# EAGLE design dev_board_v0.1 (EAGLE 8.0.1)
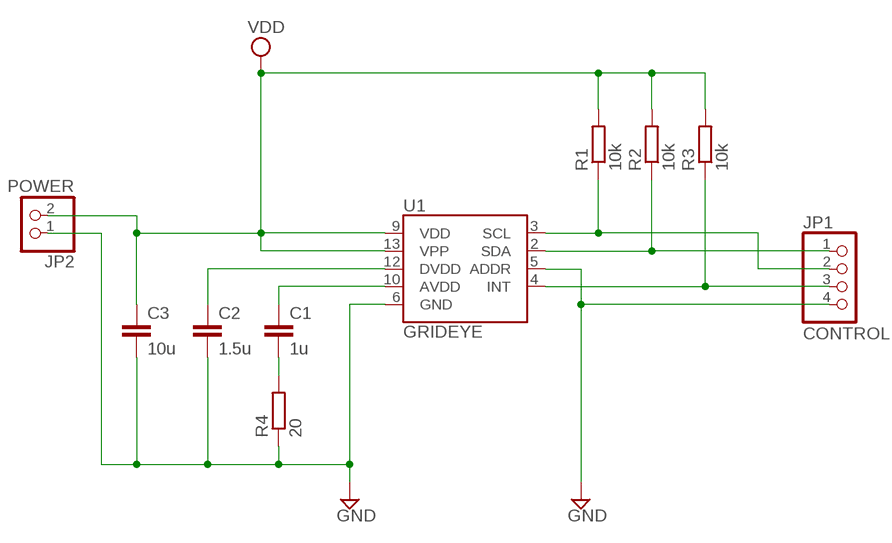
[diagram p0: schematic, sheet 1]

## Parts
C1  1u  C-EUC0805  [C0805]
C2  1.5u  C-EUC0805  [C0805]
C3  10u  C-EUC0805  [C0805]
JP1  CONTROL  PINHD-1X4  [1X04]
JP2  POWER  PINHD-1X2  [1X02]
R1  10k  R-EU_R0805  [R0805]
R2  10k  R-EU_R0805  [R0805]
R3  10k  R-EU_R0805  [R0805]
R4  20  R-EU_R0805  [R0805]
U1  GRIDEYE  [GRIDEYE-AMG88]

## Nets
AVDD: C1.1 U1.10(AVDD)
DVDD: C2.1 U1.12(DVDD)
GND: C2.2 C3.2 JP1.4 JP2.1 R4.1 U1.5(ADDR) U1.6(GND)
INT: JP1.3 R3.1 U1.4(INT)
N$6: C1.2 R4.2
SCL: JP1.2 R1.1 U1.3(SCL)
SDA: JP1.1 R2.1 U1.2(SDA)
VDD: C3.1 JP2.2 R1.2 R2.2 R3.2 U1.9(VDD) U1.13(VPP)

## Library data of the parts
C1-C3 = resistor:C-EU: CAPACITOR, European symbol
JP1 = pinhead:PINHD-1X4: PIN HEADER
JP2 = pinhead:PINHD-1X2: PIN HEADER
R1-R4 = resistor:R-EU_: RESISTOR, European symbol
U1 = Grideye:GRIDEYE

## Board
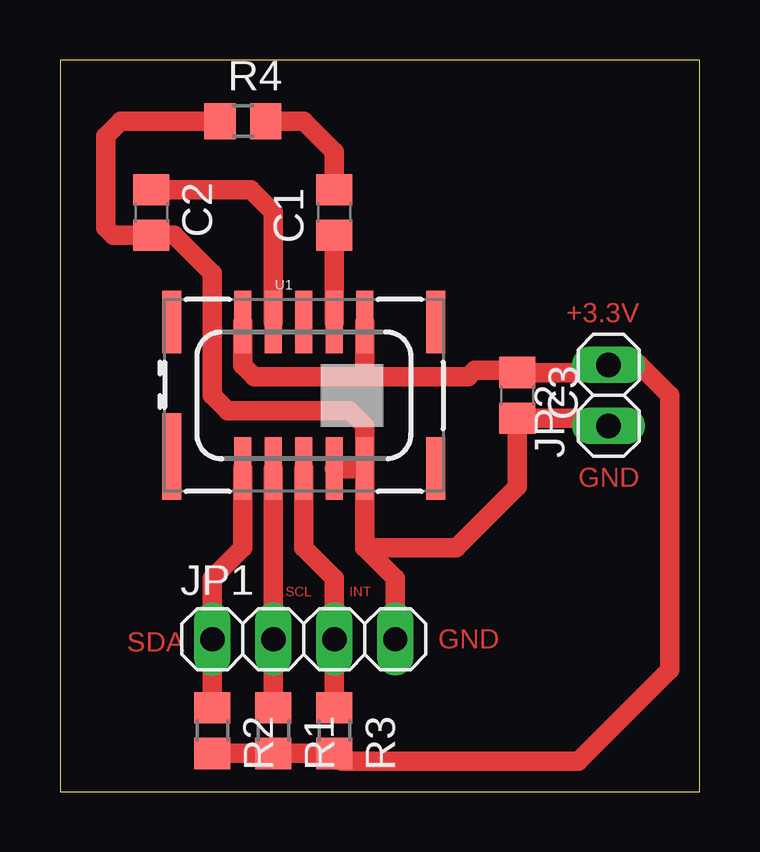
[diagram p1: board, top side]

Size 26.65 x 30.48 mm. Coordinates in mm from the lower left corner, seen from the top.
Outline: 0,0 26.65,0 26.65,30.48 0,30.48 0,0
Copper layers (1*16): Top 0.035mm / dielectric 1.5mm / Bottom 0.035mm
Design rules "default": minimum track width 10mil, minimum drill 24mil, track to track 8mil, track to pad 8mil, pad to pad 8mil, via to via 8mil, smd to smd 8mil, copper to edge 40mil, drill to drill 8mil, minimum pad ring 10mil, minimum via ring 8mil, stop-mask expansion 4mil, vias tented up to drill 0mil, thermal gap 10mil

### Footprints (pad centres in the part's own frame; a part is rotated, then mirrored left to right if it is on the bottom)
C0805 = smd 1.3 x 1.5: 1 -0.95,0; 2 0.95,0
1X04 = drill 1.016 long: 1 -3.81,0; 2 -1.27,0; 3 1.27,0; 4 3.81,0
1X02 = drill 1.016 long: 1 -1.27,0; 2 1.27,0
R0805 = smd 1.3 x 1.5: 1 -0.95,0; 2 0.95,0
GRIDEYE-AMG88 = smd 0.8 x 3.6: 1 -5.5,-2.55 | smd 0.7 x 2.6: 2 -2.54,-3.05; 3 -1.27,-3.05; 4 0,-3.05; 5 1.27,-3.05; 6 2.54,-3.05; 9 2.54,3.05; 10 1.27,3.05; 11 0,3.05; 12 -1.27,3.05; 13 -2.54,3.05 | smd 0.8 x 2.6: 7 5.5,-3.05; 8 5.5,3.05; 14 -5.5,3.05

### Placement (x,y rotation side)
C1  11.43,24.13 90 top
C2  3.81,24.13 270 top
C3  19.05,16.51 270 top
JP1  10.16,6.35 0 top
JP2  22.86,16.51 90 top
R1  8.89,2.54 270 top
R2  6.35,2.54 270 top
R3  11.43,2.54 270 top
R4  7.62,27.94 0 top
U1  10.16,16.51 0 top

### Tracks (layer width: path | path; a pad name or v marks a point on that pad's centre or on a via)
AVDD
  Top 0.813: U1.10 C1.1
DVDD
  Top 0.813: C2.1 7.94,25.08 8.89,24.13 U1.12
GND
  Top 0.813: R4.1 2.54,27.94 1.91,27.3 1.91,23.5 2.22,23.18 C2.2 4.76,23.18 6.35,21.59 6.35,16.51 6.99,15.88 12.06,15.88 12.7,15.24 U1.6 | 12.7,10.16 16.51,10.16 19.05,12.7 C3.2 22.54,15.56 JP2.1 | U1.6 12.7,11.43 12.7,10.16 | 12.7,10.16 13.97,8.89 JP1.4 | U1.6 U1.5
INT
  Top 0.813: U1.4 10.16,10.16 11.43,8.89 JP1.3 R3.1
N$6
  Top 0.813: C1.2 11.43,26.67 10.16,27.94 R4.2
SCL
  Top 0.813: U1.3 JP1.2 R1.1
SDA
  Top 0.813: U1.2 7.62,10.16 6.35,8.89 JP1.1 R2.1
VDD
  Top 0.813: R2.2 R1.2 R3.2 11.75,1.27 21.59,1.27 25.4,5.08 25.4,16.51 24.13,17.78 JP2.2 22.54,17.46 C3.1 18.96,17.55 17.28,17.55 17.01,17.28 12.7,17.28 | U1.13 7.62,17.76 8.1,17.28 12.7,17.28 | U1.9 12.7,17.28

### Text on the board
Top: +3.3V | GND | SCL | INT | SDA | GND